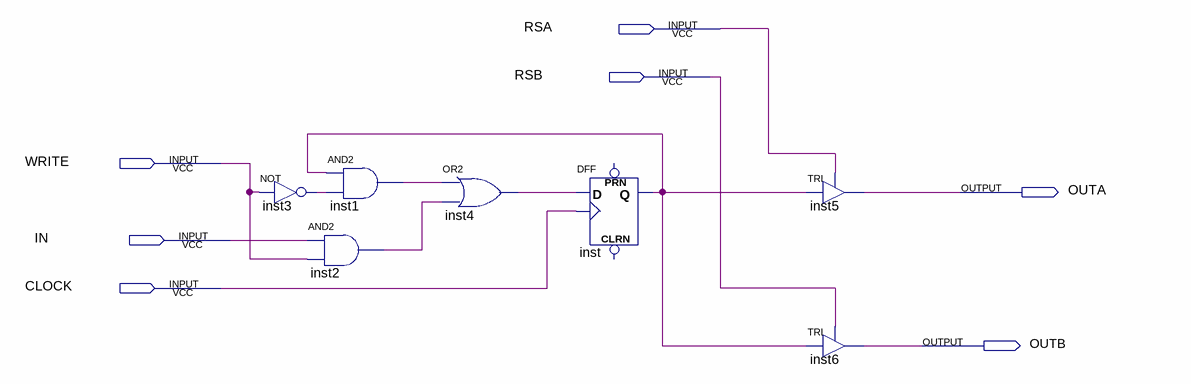
[diagram p0: schematic sheet]
// Quartus schematic RFC.bdf as structural Verilog: 7 symbols, 7 pins
module RFC (
  input  RSA,
  input  RSB,
  input  WRITE,
  input  IN,
  input  CLOCK,
  output OUTA,
  output OUTB
);

  wire inst1_out, inst2_out, inst3_out, inst4_out, inst_q;

  not inst3 (inst3_out, WRITE);
  and inst2 (inst2_out, IN, WRITE);
  and inst1 (inst1_out, inst_q, inst3_out);
  or inst4 (inst4_out, inst1_out, inst2_out);
  DFF inst (.CLK(CLOCK), .D(inst4_out), .Q(inst_q));  // open: CLRN, PRN
  TRI inst5 (.IN(inst_q), .OE(RSA), .OUT(OUTA));
  TRI inst6 (.IN(inst_q), .OE(RSB), .OUT(OUTB));
endmodule
